# Altium schematic sheet slapcie.SchDoc
size A4
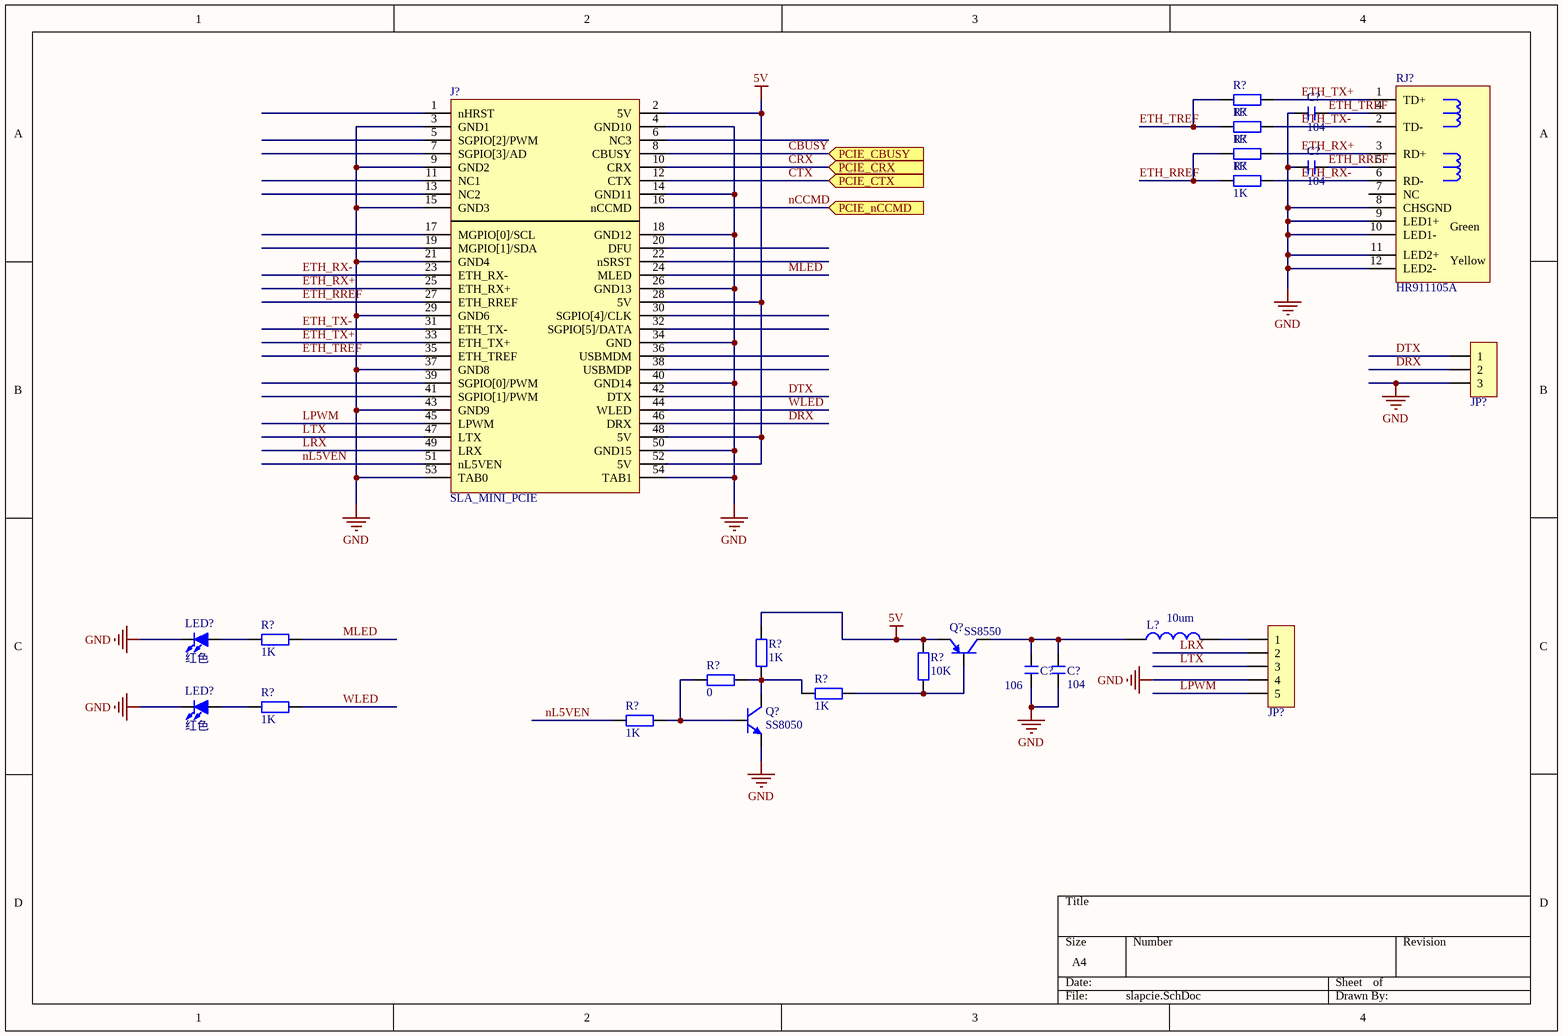
[diagram p0: slapcie.SchDoc]

## Parts
(Parts that share a designator on the sheet are numbered #1, #2 ... from top to bottom, then left to right.)
C?#1  104  [C 0603_L]
C?#2  104  [C 0603_L]
C?#3  104  [C 0603_L]
C?#4  106  [C 0603_L]
J?  SLA_MINI_PCIE  [MINI_PCIE]
JP?#1  HDR-1X3  [XH2.54-LI-3P]  (value not drawn)
JP?#2  HDR-1X5  [XH2.54-WI-5P]  (value not drawn)
L?  10um  [L 0805]
LED?#1  红色  [LED 0603R]
LED?#2  红色  [LED 0603R]
Q?#1  SS8550  [SOT23-3N]
Q?#2  SS8050  [SOT23-3N]
R?#1  1K  [R 0603_L]
R?#2  1K  [R 0603_L]
R?#3  1K  [R 0603_L]
R?#4  1K  [R 0603_L]
R?#5  1K  [R 0603_L]
R?#6  0  [R 0603_L]
R?#7  1K  [R 0603_L]
R?#8  1K  [R 0603_L]
R?#9  10K  [R 0603_L]
R?#10  1K  [R 0603_L]
R?#11  1K  [R 0603_L]
RJ?  HR911105A  [RJ-45A12]

## Ports
PCIE_CBUSY (in), PCIE_CRX (in), PCIE_CTX (in), PCIE_nCCMD (in)

## Nets
5V: J?.2(5V) J?.28(5V) J?.48(5V) J?.52(5V) Q?#1.2(E) R?#7.2 R?#9.2
GND: C?#1.1 C?#2.1 C?#3.2 C?#4.1 J?.3(GND1) J?.4(GND10) J?.9(GND2) J?.14(GND11) J?.15(GND3) J?.18(GND12) J?.21(GND4) J?.26(GND13) J?.29(GND6) J?.34(GND) J?.37(GND8) J?.40(GND14) J?.43(GND9) J?.50(GND15) J?.53(TAB0) J?.54(TAB1) JP?#1.3 JP?#2.4 LED?#1.2(K) LED?#2.2(K) Q?#2.2(E) RJ?.8(CHSGND) RJ?.9(LED1+) RJ?.10(LED1-) RJ?.11(LED2+) RJ?.12(LED2-)
CBUSY: J?.8(CBUSY) ; port PCIE_CBUSY
CRX: J?.10(CRX) ; port PCIE_CRX
CTX: J?.12(CTX) ; port PCIE_CTX
DRX: J?.46(DRX) JP?#1.2
DTX: J?.42(DTX) JP?#1.1
ETH_RREF: C?#2.2 J?.27(ETH_RREF) R?#3.1 R?#4.1 RJ?.5
ETH_RX+: J?.25(ETH_RX+) R?#3.2 RJ?.3(RD+)
ETH_RX-: J?.23(ETH_RX-) R?#4.2 RJ?.6(RD-)
ETH_TREF: C?#1.2 J?.35(ETH_TREF) R?#1.1 R?#2.1 RJ?.4
ETH_TX+: J?.33(ETH_TX+) R?#1.2 RJ?.1(TD+)
ETH_TX-: J?.31(ETH_TX-) R?#2.2 RJ?.2(TD-)
LPWM: J?.45(LPWM) JP?#2.5
LRX: J?.49(LRX) JP?#2.2
LTX: J?.47(LTX) JP?#2.3
MLED: J?.24(MLED) R?#5.2
nCCMD: J?.16(nCCMD) ; port PCIE_nCCMD
nL5VEN: J?.51(nL5VEN) R?#11.1
WLED: J?.44(WLED) R?#10.2
NetC?#3_1: C?#3.1 C?#4.2 L?.1 Q?#1.3(C)
NetJP?#2_1: JP?#2.1 L?.2
NetLED?#1_1: LED?#1.1(A) R?#5.1
NetLED?#2_1: LED?#2.1(A) R?#10.1
NetQ?#1_1: Q?#1.1(B) R?#8.2 R?#9.1
NetQ?#2_1: Q?#2.1(B) R?#6.1 R?#11.2
NetQ?#2_3: Q?#2.3(C) R?#6.2 R?#7.1 R?#8.1

Not connected (* = marked no-connect by the designer): J? 1(nHRST) 5(SGPIO[2]/PWM) 6(NC3) 7(SGPIO[3]/AD) 11(NC1) 13(NC2) 17(MGPIO[0]/SCL) 19(MGPIO[1]/SDA) 20(DFU) 22(nSRST) 30(SGPIO[4]/CLK) 32(SGPIO[5]/DATA) 36(USBMDM) 38(USBMDP) 39(SGPIO[0]/PWM) 41(SGPIO[1]/PWM); RJ? 7(NC)

## Notes on the sheet
- (in symbol HR911105A) Green; Yellow

## Library data of the parts
C?#1-C?#4 = C: 无极性贴片电容; 版权归属: 源创客; BOM名称: 无极性贴片电容; 学习资源: www.ooocke.com
J? = SLA_PCIE
JP?#1 = Header 3: 3P接插件; 版权归属: 源创客; BOM名称: 3P接插件; 学习资源: www.ooocke.com
JP?#2 = Header 5: 5P接插件; 版权归属: 源创客; BOM名称: 5P接插件; 学习资源: www.ooocke.com
L? = L: 小功率贴片电感; 版权归属: 源创客; BOM名称: 小功率贴片电感; 学习资源: www.ooocke.com
LED?#1 LED?#2 = LED-SMD: 贴片LED; 版权归属: 源创客; BOM名称: 贴片LED; 学习资源: www.ooocke.com
Q?#1 = 8550-SMD: 高频放大-PNP型; 版权归属: 源创客; 属性: 40V 1.5A 1W 100MHZ; BOM名称: 高频放大-PNP型; 学习资源: www.ooocke.com
Q?#2 = 8050-SMD: 高频放大-NPN型; 版权归属: 源创客; 属性: 40V 1.5A 1W 100MHZ; BOM名称: 高频放大-NPN型; 学习资源: www.ooocke.com
R?#1-R?#11 = R: 贴片电阻; 版权归属: 源创客; BOM名称: 贴片电阻; 学习资源: www.ooocke.com
RJ? = HR911105A: 带灯以太网接口; 版权归属: 源创客; BOM名称: 带灯以太网接口; 学习资源: www.ooocke.com